# EAGLE design module (EAGLE 8.6.0)
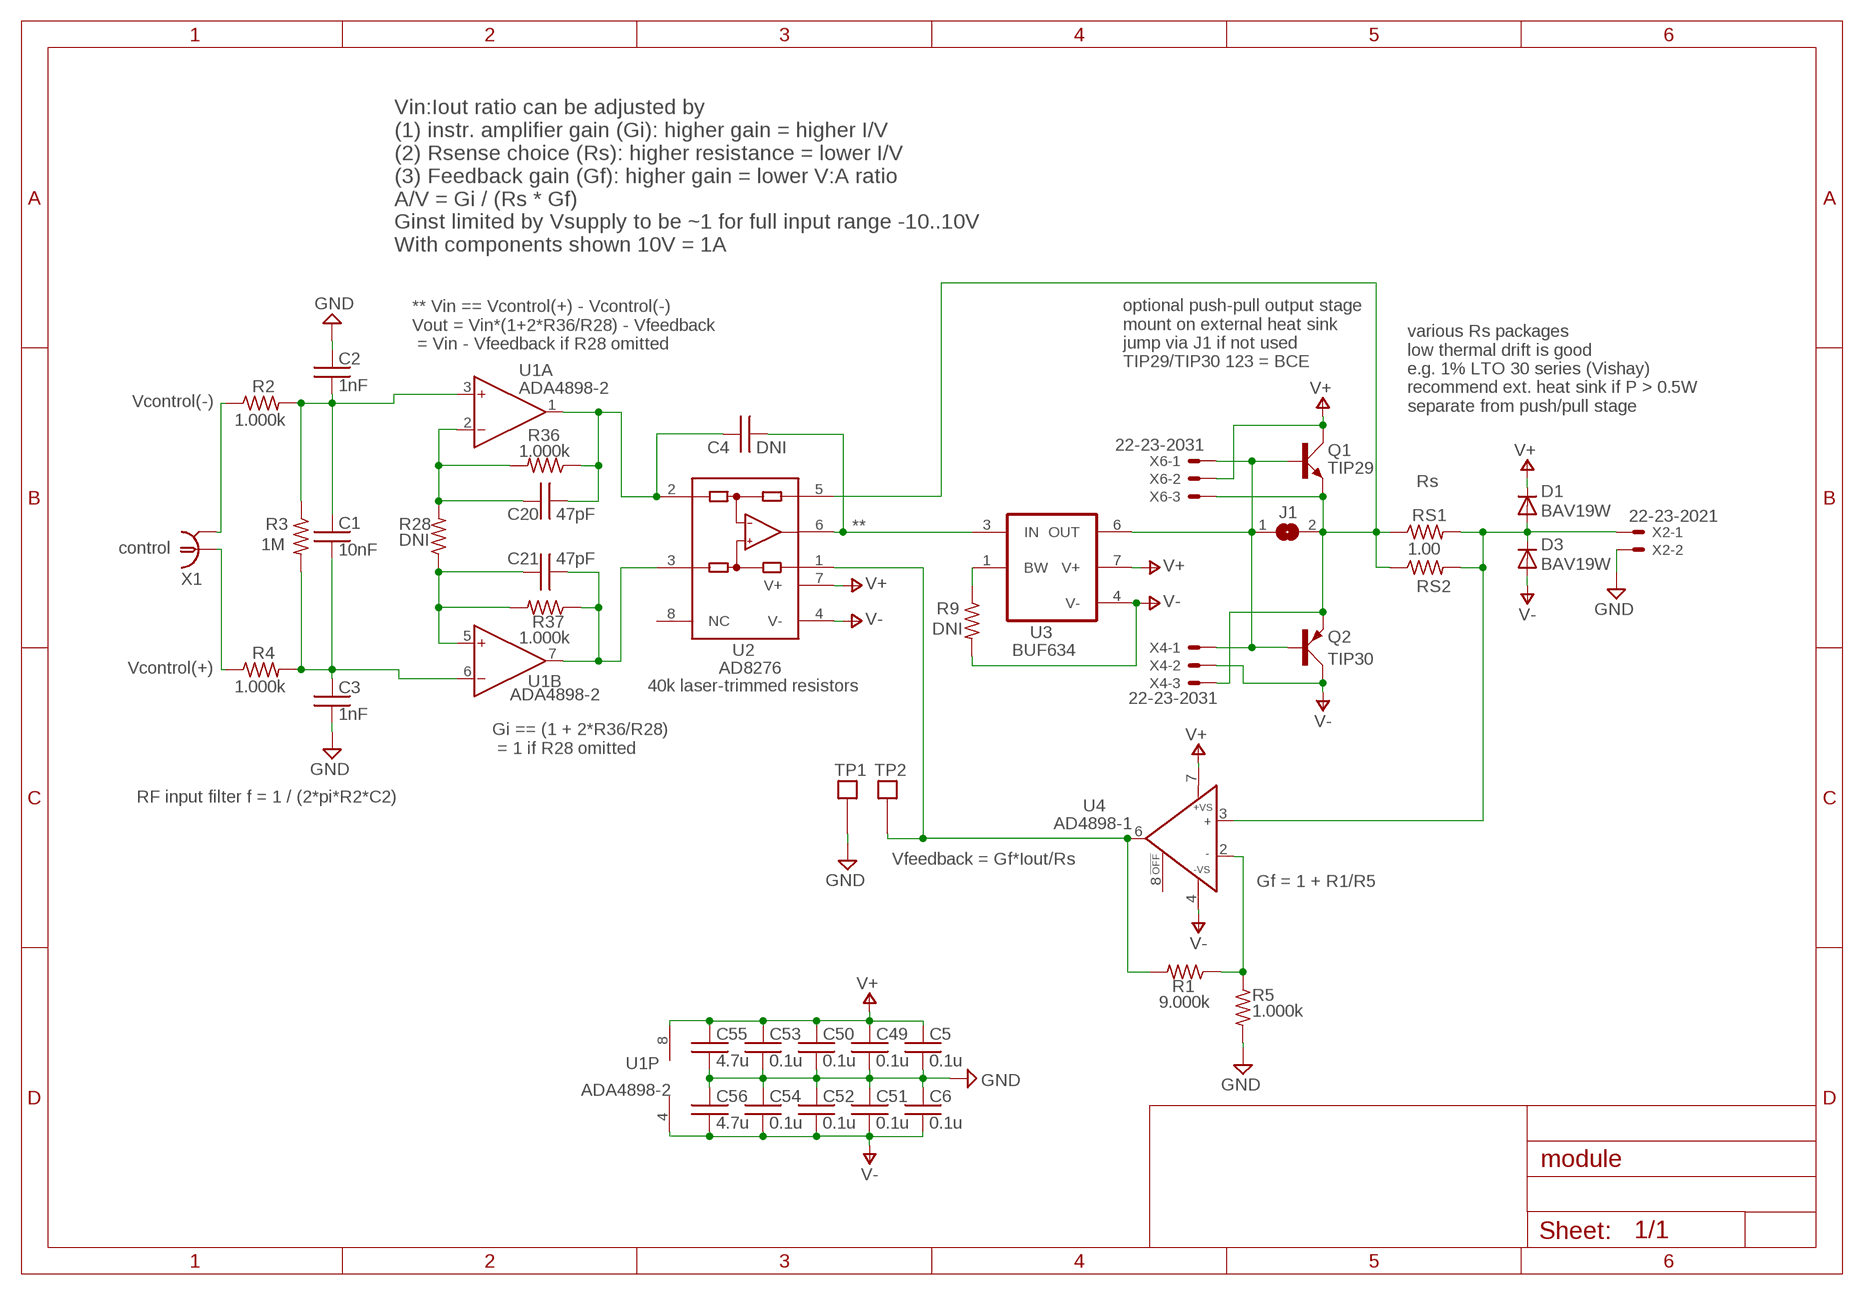
[diagram p0: schematic, sheet 1]

## Parts
C1  10nF  C0603  [0603]
C2  1nF  C0603  [0603]
C3  1nF  C0603  [0603]
C4  DNI  C0603  [0603]
C5  0.1u  C0603  [0603]
C6  0.1u  C0603  [0603]
C20  47pF  C0603  [0603]
C21  47pF  C0603  [0603]
C49  0.1u  C0603  [0603]
C50  0.1u  C0603  [0603]
C51  0.1u  C0603  [0603]
C52  0.1u  C0603  [0603]
C53  0.1u  C0603  [0603]
C54  0.1u  C0603  [0603]
C55  4.7u  C0603  [0603]
C56  4.7u  C0603  [0603]
D1  BAV19W  DIODE-SOD123  [SOD123]
D3  BAV19W  DIODE-SOD123  [SOD123]
J1  SJ  [SJ]
Q1  TIP29  TIP41C  [TO220AV]
Q2  TIP30  TIP42C  [TO220AV]
R1  9.000k  R0603  [0603]
R2  1.000k  R0603  [0603]
R3  1M  R0603  [0603]
R4  1.000k  R0603  [0603]
R5  1.000k  R0603  [0603]
R9  DNI  R0603  [0603]
R28  DNI  R0603  [0603]
R36  1.000k  R0603  [0603]
R37  1.000k  R0603  [0603]
RS1  1.00  LT030  [LTO30]
RS2  DNI  RESISTOR2512  [2512]
TP1  TESTPOINT  [TESTPOINT]
TP2  TESTPOINT  [TESTPOINT]
U1  ADA4898-2  ADA4898-2R  [SO8]
U2  AD8276  [SO8]
U3  BUF634  [SO8]
U4  AD4898-1  ADA4898-1R  [SO8]
X1  1-227161-0  [AMP_227161]
X2  22-23-2021  [22-23-2021]
X4  22-23-2031  [22-23-2031]
X6  22-23-2031  [22-23-2031]

## Nets
GND: C2.1 C3.2 C5.2 C6.1 C49.2 C50.2 C51.1 C52.1 C53.2 C54.1 C55.2 C56.1 R5.2 TP1.P$1 X2.2
N$1: R2.1 X1.2
N$2: R4.1 X1.1
N$3: C4.2 U2.6(OUT) U3.3(IN)
N$5: C1.1 C2.2 R2.2 R3.1 U1.3(A:IN+)
N$6: C1.2 C3.1 R3.2 R4.2 U1.6(B:IN-)
N$7: R1.1 R5.1 U4.2(IN-)
N$9: J1.1 Q1.B Q2.B U3.6(OUT) X4.1 X6.1
N$11: D1.A D3.C RS1.P$2 RS2.2 U4.3(IN+) X2.1
N$12: J1.2 Q1.E Q2.E RS1.P$1 RS2.1 U2.5(SENSE) X4.3 X6.3
N$14: R9.1 U3.1(BW)
N$15: R1.2 TP2.P$1 U2.1(REF) U4.6(OUT)
N$26: C20.1 R28.2 R36.2 U1.2(A:IN-)
N$31: C21.1 R28.1 R37.2 U1.5(B:IN+)
N$33: C21.2 R37.1 U1.7(B:OUT) U2.3(+IN)
N$35: C4.1 C20.2 R36.1 U1.1(A:OUT) U2.2(-IN)
V+: C5.1 C49.1 C50.1 C53.1 C55.1 D1.C Q1.C U1.8(P:V+) U2.7(V+) U3.7(V+) U4.7(+VS) X6.2
V-: C6.2 C51.2 C52.2 C54.2 C56.2 D3.A Q2.C R9.2 U1.4(P:V-) U2.4(V-) U3.4(V-) U4.4(-VS) X4.2
Unconnected: U2.8(NC) U4.8(OFF)

## Notes on the sheet
- Vin:Iout ratio can be adjusted by 
  (1) instr. amplifier gain (Gi): higher gain = higher I/V
  (2) Rsense choice (Rs): higher resistance = lower I/V
  (3) Feedback gain (Gf): higher gain = lower V:A ratio
  A/V = Gi / (Rs * Gf)
  Ginst limited by Vsupply to be ~1 for full input range -10..10V
  With components shown 10V = 1A
- ** Vin == Vcontrol(+) - Vcontrol(-)
  Vout = Vin*(1+2*R36/R28) - Vfeedback
   = Vin - Vfeedback if R28 omitted
- optional push-pull output stage
  mount on external heat sink
  jump via J1 if not used
  TIP29/TIP30 123 = BCE
- Vcontrol(-)
- various Rs packages
  low thermal drift is good
  e.g. 1% LTO 30 series (Vishay)
  recommend ext. heat sink if P > 0.5W
  separate from push/pull stage
- Rs
- **
- control
- Vcontrol(+)
- 40k laser-trimmed resistors
- Gi == (1 + 2*R36/R28)
   = 1 if R28 omitted
- RF input filter f = 1 / (2*pi*R2*C2)
- Vfeedback = Gf*Iout/Rs
- Gf = 1 + R1/R5

## Library data of the parts
C1-C6 C20 C21 C49-C56 = acrooptics:C: Capacitor
D1 D3 = AquariumLibrary:DIODE-: DIODE
J1 = acrooptics:SJ: SMD solder JUMPER
Q1 = transistor-power:TIP41C: NPN TRANSISTOR
Q2 = transistor-power:TIP42C: PNP TRANSISTOR
R1-R5 R9 R28 R36 R37 = acrooptics:R: 0603 resistor
RS1 = noah:LT030
RS2 = noah:RESISTOR: RESISTOR, American symbol
TP1 TP2 = Fitch:TESTPOINT
U1 = noah:ADA4898-2: General-Purpose CMOS Rail-to-Rail Amplifiers Source: http://www.analog.com/static/imported-files/data_sheets/AD8541_8542_8544.pdf; MF: ALTERA CORPORATION; MPN: AD8542ARZ-REEL; OC_FARNELL: 1424150; OC_NEWARK: 59K6827
U2 = noah:AD8276: Precision Unity Gain Diff. Amplifier
U3 = noah:BUF634: 250mA High-Speed Buffer
U4 = noah:ADA4898-1; MF: ANALOG DEVICES; MPN: AD744JR; OC_FARNELL: 1651300; OC_NEWARK: 05F7341
X1 = con-coax:?227161*: JACK, RIGHT ANGLE, 50 OHM, PCB, BNC Source: amp_227161.pdf; MF: TYCO ELECTRONICS; MPN: 1-227161; OC_FARNELL: unknown; OC_NEWARK: 33B3200
X2 = con-molex:22-23-2021: .100" (2.54mm) Center Header - 2 Pin; MF: MOLEX; MPN: 22-23-2021; OC_FARNELL: 1462926; OC_NEWARK: 25C3832
X4 X6 = con-molex:22-23-2031: .100" (2.54mm) Center Header - 3 Pin; MF: MOLEX; MPN: 22-23-2031; OC_FARNELL: 1462950; OC_NEWARK: 30C0862

## Net classes
1 standard: width 0.61 mm, clearance 0.254 mm

## Board
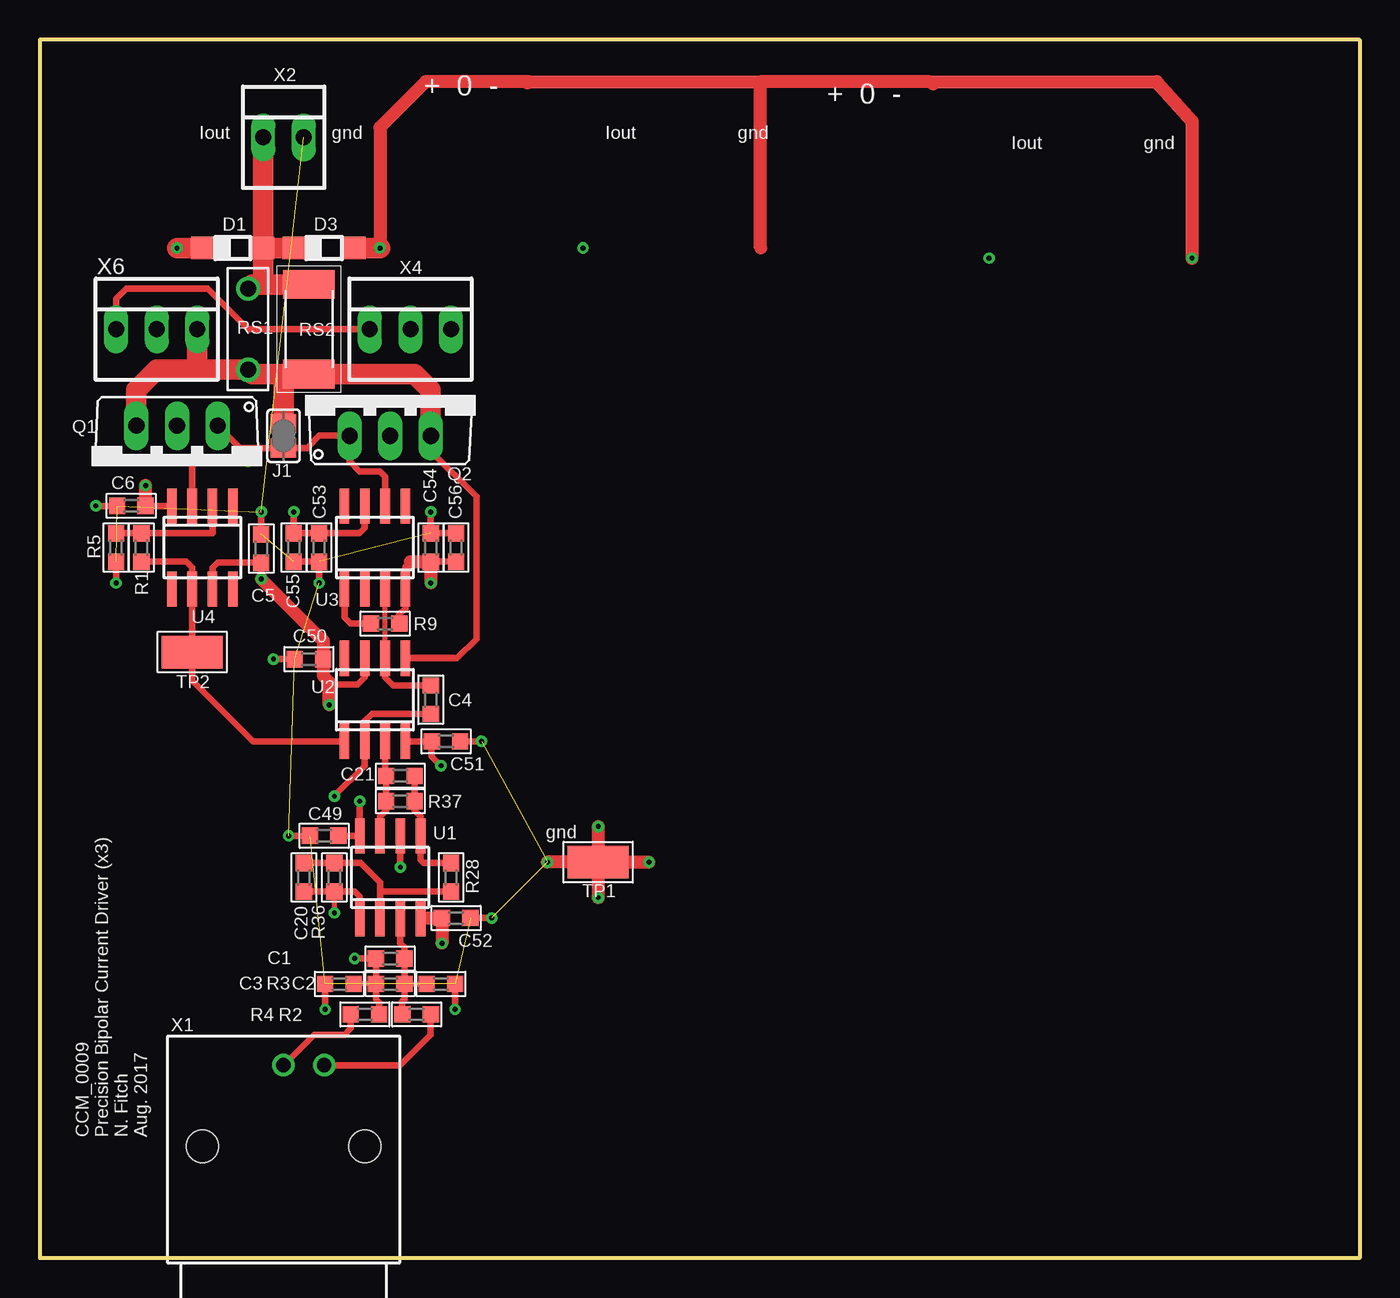
[diagram p1: board, top side]
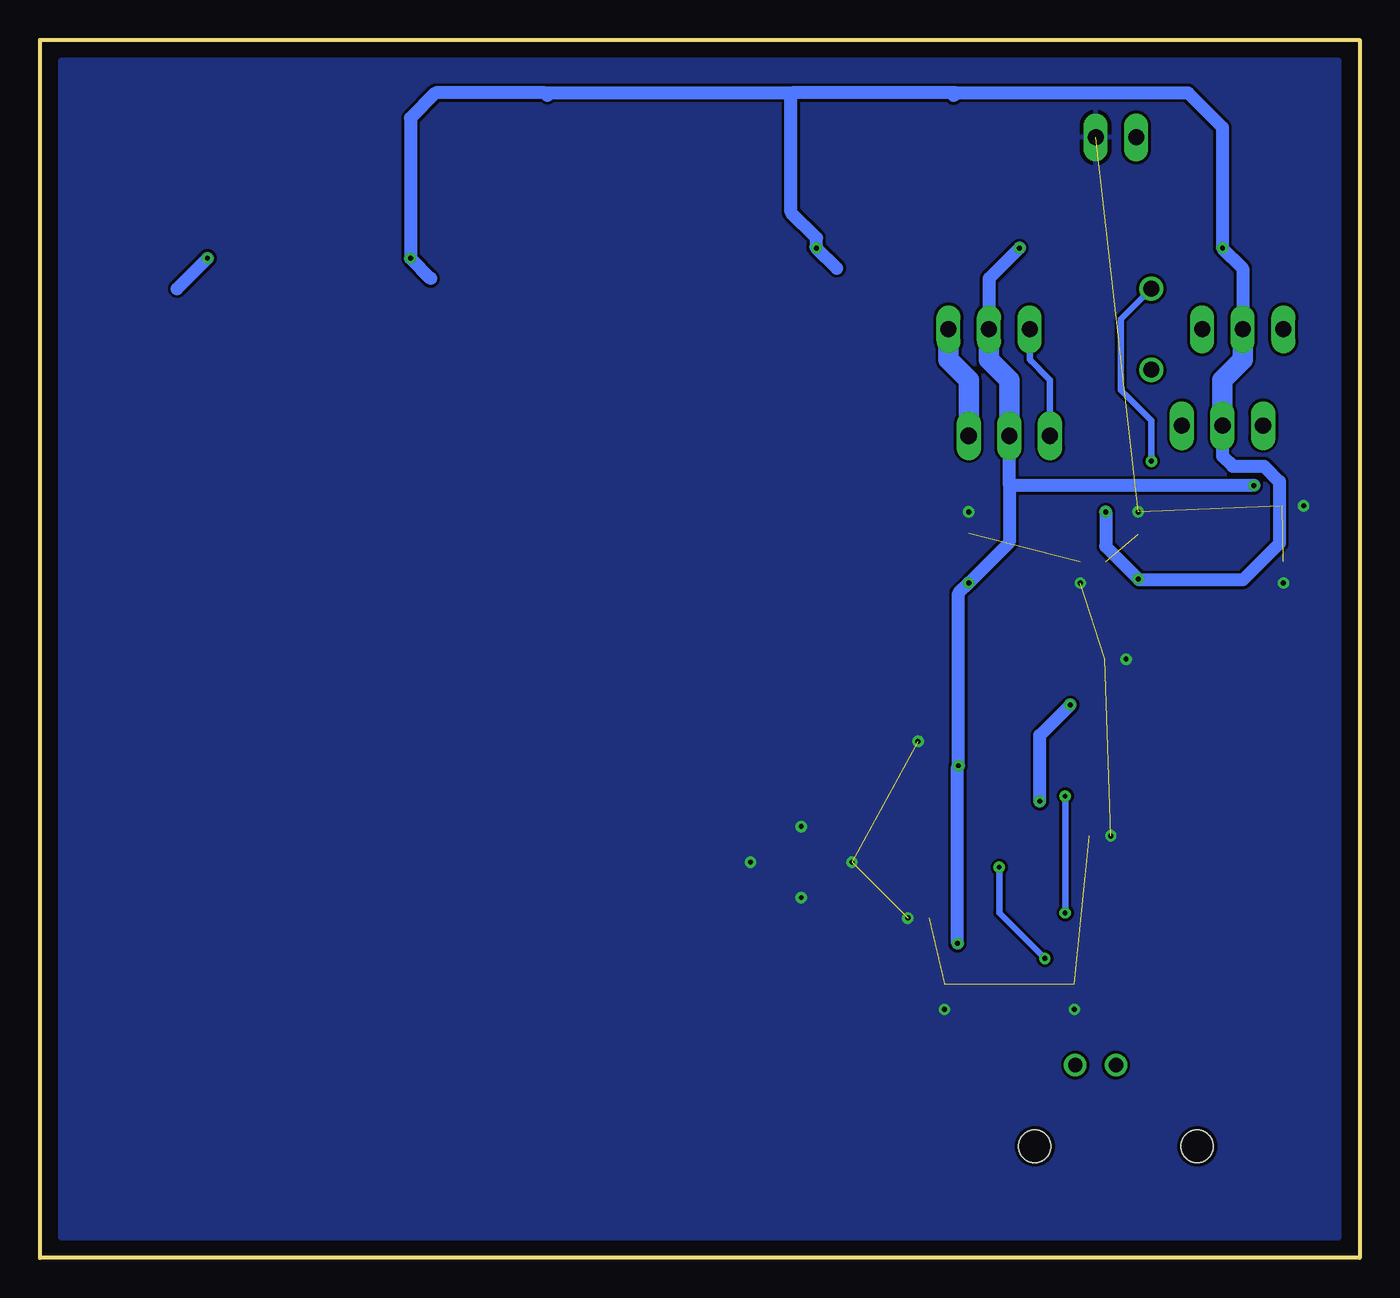
[diagram p2: board, bottom side, seen from below]

Size 82.55 x 76.2 mm. Coordinates in mm from the lower left corner, seen from the top.
Outline: 0,0 82.55,0 82.55,76.2 0,76.2 0,0
Copper layers (1*16): Top 0.035mm / dielectric 1.5mm / Bottom 0.035mm
Design rules "default *": minimum track width 10mil, minimum drill 10mil, track to track 7mil, track to pad 7mil, pad to pad 7mil, via to via 7mil, smd to smd 7mil, copper to edge 10mil, drill to drill 8mil, minimum pad ring 10mil, minimum via ring 8mil, stop-mask expansion 4mil, vias tented up to drill 0mil, thermal gap 10mil

### Footprints (pad centres in the part's own frame; a part is rotated, then mirrored left to right if it is on the bottom)
0603 = smd 1.016 x 1.016: 1 -0.889,0; 2 0.889,0
SOD123 = smd 1.4 x 1.4: A 1.9,0; C -1.9,0
SJ = smd 1.168 x 1.6: 1 -0.762,0; 2 0.762,0
TO220AV = drill 1.016 long: B -2.54,-2.54; C 0,-2.54; E 2.54,-2.54
LTO30 = drill 1: P$1 0,0; P$2 5.08,0
2512 = smd 1.8 x 3.2: 1 -2.8,0; 2 2.8,0
TESTPOINT = smd 3.81 x 2.032: P$1 0,0
SO8 = smd 0.6 x 2.2: 1 -1.905,-2.6; 2 -0.635,-2.6; 3 0.635,-2.6; 4 1.905,-2.6; 5 1.905,2.6; 6 0.635,2.6; 7 -0.635,2.6; 8 -1.905,2.6
AMP_227161 = drill 0.9 pad 1.27: 1 0,-5.08; 2 -2.54,-5.08 | hole 2: -5.08,0; 5.08,0
22-23-2021 = drill 1 long: 1 -1.27,0; 2 1.27,0
22-23-2031 = drill 1 long: 1 -2.54,0; 2 0,0; 3 2.54,0

### Placement (x,y rotation side)
C1  21.91,18.73 180 top
C2  25.08,17.14 180 top
C3  18.73,17.14 180 top
C4  24.45,34.92 90 top
C5  13.84,44.39 90 top
C6  5.71,47.05 0 top
C20  16.51,23.81 270 top
C21  22.54,30.16 180 top
C49  17.78,26.42 180 top
C50  16.83,37.47 180 top
C51  25.4,32.32 180 top
C52  26.04,21.27 180 top
C53  17.46,44.45 270 top
C54  24.45,44.45 270 top
C55  15.88,44.45 270 top
C56  26.04,44.45 270 top
D1  12.06,63.18 0 top
D3  17.78,63.18 0 top
J1  15.24,51.44 90 top
Q1  8.57,49.53 180 top
Q2  21.91,53.98 0 top
R1  6.35,44.45 270 top
R2  23.56,15.24 180 top
R3  21.91,17.14 180 top
R4  20.32,15.24 0 top
R5  4.76,44.45 270 top
R9  21.59,39.69 0 top
R28  25.72,23.81 270 top
R36  18.41,23.81 90 top
R37  22.54,28.57 0 top
RS1  13.02,55.56 90 top
RS2  16.83,58.1 90 top
TP1  34.92,24.77 0 top
TP2  9.53,37.91 0 top
U1  21.91,23.81 0 top
U2  20.95,34.92 0 top
U3  20.95,44.45 0 top
U4  10.16,44.45 180 top
X1  15.24,6.99 180 top
X2  15.24,70.1 0 top
X4  23.18,58.1 0 top
X6  7.3,58.1 0 top

### Tracks (layer width: path | path; a pad name or v marks a point on that pad's centre or on a via)
GND  (via drill 0.3)  (12 unrouted)
  Top 0.406: C3.2 v17.84,15.56 | C2.1 v25.97,15.56 | C51.1 v27.62,32.32 | C55.2 C53.2 v17.46,42.23 | C56.1 C54.1 v24.45,46.67 | v15.56,26.42 C49.2 | v4.76,42.23 R5.2 | C6.1 v3.49,47.05 | C5.2 v13.84,46.67 | C50.2 v14.61,37.47 | C52.1 v28.26,21.27
  Top 0.813: v34.92,26.99 TP1.P$1 | TP1.P$1 v31.75,24.77 | TP1.P$1 v38.1,24.77 | TP1.P$1 v34.92,22.54
  pour Bottom: 1.27,1.27 1.27,74.93 81.28,74.93 81.28,1.27
N$1
  Top 0.406: X1.2 22.54,12.06 24.45,13.97 R2.1
N$2
  Top 0.406: R4.1 19.43,14.35 19.05,13.97 17.14,13.97 X1.1
N$3
  Top 0.305: U2.6 U3.3
  Top 0.406: C4.2 22.1,35.81 21.59,36.32 U2.6
N$5
  Top 0.305: R3.1 C2.2
  Top 0.406: U1.3 22.54,19.68 22.8,19.43 C1.1 R3.1 22.8,16.19 22.67,16.07 R2.2
N$6  (via drill 0.3)
  Top 0.305: R3.2 C3.1
  Top 0.406: U1.6 v22.54,24.45 | v19.68,18.73 C1.2 R3.2 21.02,16.19 21.21,16 R4.2
  Bottom 0.406: v22.54,24.45 22.54,21.59 v19.68,18.73
N$7
  Top 0.406: U4.2 10.79,45.36 10.81,45.34 R1.1 R5.1
N$9
  Top 0.406: 19.24,51.44 17.46,51.44 16.7,50.67 J1.1 12.51,50.67 Q1.B | 19.24,51.44 Q2.B | X6.1 4.76,60.01 5.4,60.64 10.48,60.64 13.02,58.1 X4.1 | U3.6 21.59,48.9 21.27,49.21 20,49.21 19.37,49.85 19.37,51.31 19.24,51.44
  Bottom 0.406: X4.1 20.64,56.2 19.37,54.93 Q2.B
N$11  (via drill 0.3)
  Top 0.406: U4.3 9.53,49.53 9.84,49.85 v13.02,49.85
  Top 1.27: 13.96,60.9 RS2.2 | 13.96,60.9 13.28,60.9 RS1.P$2 | D3.C D1.A | D1.A 13.96,60.9 | 13.96,60.9 | D1.A X2.1
  Bottom 0.406: v13.02,49.85 13.02,52.39 14.92,54.29 14.92,58.74 RS1.P$2
N$12
  Top 0.406: Q2.E 24.45,50.48 27.3,47.62 27.3,38.73 26.1,37.53 22.87,37.53 U2.5
  Top 1.27: 15.05,55.3 RS2.1 23.44,55.3 24.45,54.29 Q2.E | 15.05,55.3 13.28,55.3 RS1.P$1 9.82,55.56 | J1.2 15.24,55.12 15.05,55.3 | 9.82,55.56 7.3,55.56 6.03,54.29 Q1.E | X6.3 9.84,55.59 9.82,55.56
  Bottom 1.27: X4.3 25.72,56.2 24.45,54.93 Q2.E
N$14
  Top 0.406: U3.1 19.05,40.07 19.43,39.69 R9.1
N$15
  Top 0.406: R1.2 9.14,43.56 9.53,43.18 U4.6 TP2.P$1 9.53,36.13 13.35,32.31 U2.1
N$26
  Top 0.305: 21.4,22.92 21.27,22.8
  Top 0.406: R28.2 21.4,22.92 | U1.2 21.27,22.8 21.27,23.5 20.07,24.7 R36.2 C20.1
N$31
  Top 0.406: C21.1 R37.2 23.43,28 23.81,27.62 U1.5 23.81,24.89 24,24.7 R28.1
N$33
  Top 0.406: U1.7 21.27,27.62 21.65,28 R37.1 C21.2 21.59,30.23 U2.3
N$35  (via drill 0.3)
  Top 0.305: R36.1 v18.41,21.59
  Top 0.406: C20.2 R36.1 19.68,22.92 20,22.61 U1.1 | C4.1 20.77,34.04 20.32,33.59 U2.2 20.32,30.8 v18.41,28.89
  Bottom 0.406: v18.41,21.59 v18.41,28.89
V+  (via drill 0.3)
  Top 0.406: C49.1 U1.8 v20,28.57 | 17.72,36.41 17.72,36.26 18.1,35.88 19.88,35.88 20.32,36.32 U2.7 | U3.7 20.32,45.66 20,45.34 C53.1 C55.1 v15.88,46.67 | U4.7 10.79,43.18 11.11,43.5 C5.1 v13.84,42.48
  Top 0.813: v13.84,42.48 17.72,38.61 C50.1 17.72,36.41 18.1,36.03 v18.1,34.61
  Top 1.27: D1.C v8.57,63.18
  Bottom 0.813: X6.2 7.3,61.91 v8.57,63.18 8.57,70.74 10.73,72.9 25.22,72.9 | v15.88,46.67 15.88,44.51 v13.84,42.48 13.78,42.42 7.3,42.42 5.02,44.7 5.02,48.58 5.97,49.53 7.94,49.53 8.57,50.16 Q1.C | v20,28.57 20,32.7 v18.1,34.61 | 32.7,61.91 v33.97,63.18 | 58.1,61.28 v59.37,62.55 59.37,71.31 57.78,72.9 50.96,72.9 | 34.04,63.25 v33.97,63.18 | 50.96,72.9 35.5,72.9 | v33.97,63.18 33.97,63.82 35.56,65.41 35.56,72.84 35.5,72.9 | 25.22,72.9 35.5,72.9 | 25.4,72.72 25.22,72.9 | 50.8,72.73 50.96,72.9
  Bottom 1.27: X6.2 7.3,56.2 8.57,54.93 Q1.C
V-  (via drill 0.3)
  Top 0.305: 24.5,32.31 C51.2
  Top 0.406: U2.4 24.5,32.31 | C54.2 C56.2 | R9.2 22.48,40.26 22.86,40.64 U3.4 22.86,43.24 23.18,43.56 | 24.26,21.27 23.87,21.27 U1.4 | C6.2 U4.4 | C51.2 24.51,31.37 v25.08,30.8
  Top 0.813: 23.18,43.56 C54.2 v24.45,42.23 | C6.2 v6.6,48.32 | 24.26,21.27 C52.2 v25.15,19.68 | v21.27,63.18 21.27,70.74 24.13,73.6 30.58,73.6 | v72.07,62.55 72.07,71.12 69.85,73.6 55.6,73.6 | 45.14,73.6 45.09,73.55 45.09,63.19 | 55.6,73.6 45.14,73.6 | 55.88,73.44 55.6,73.6 | 30.58,73.6 45.14,73.6 | 30.48,73.5 30.58,73.6
  Top 1.27: D3.A v21.27,63.18
  Bottom 0.813: 21.91,48.46 21.91,44.77 v24.45,42.23 25.08,41.59 v25.08,30.8 25.15,30.73 v25.15,19.68 | 21.91,48.46 Q2.C | v21.27,63.18 23.18,61.28 X4.2 | v6.6,48.32 21.89,48.32 21.91,48.46 | v72.07,62.55 73.98,60.64
  Bottom 1.27: Q2.C 21.91,54.93 23.18,56.2 X4.2

### Text on the board
tPlace: + 0 - | + 0 - | Iout | gnd | Iout | gnd | Iout | gnd | gnd | CCM_0009 / Precision Bipolar Current Driver (x3) / N. Fitch / Aug. 2017